# Altium schematic sheet fpga-enet2.SchDoc: Ethernet FPGA
size Legal; CheckedBy: J. Brinton; CompanyName: Signal Laboratories, Inc.; DrawnBy: J. Brinton; Engineer: J. Brinton; Address1: 3479 Edison Way; Address2: Menlo Park CA 94025; Address3: +1 (877) 778-8435; Address4: siglabs.com; DocumentNumber: 26; Revision: 2b; SheetNumber: 27; SheetTotal: 58
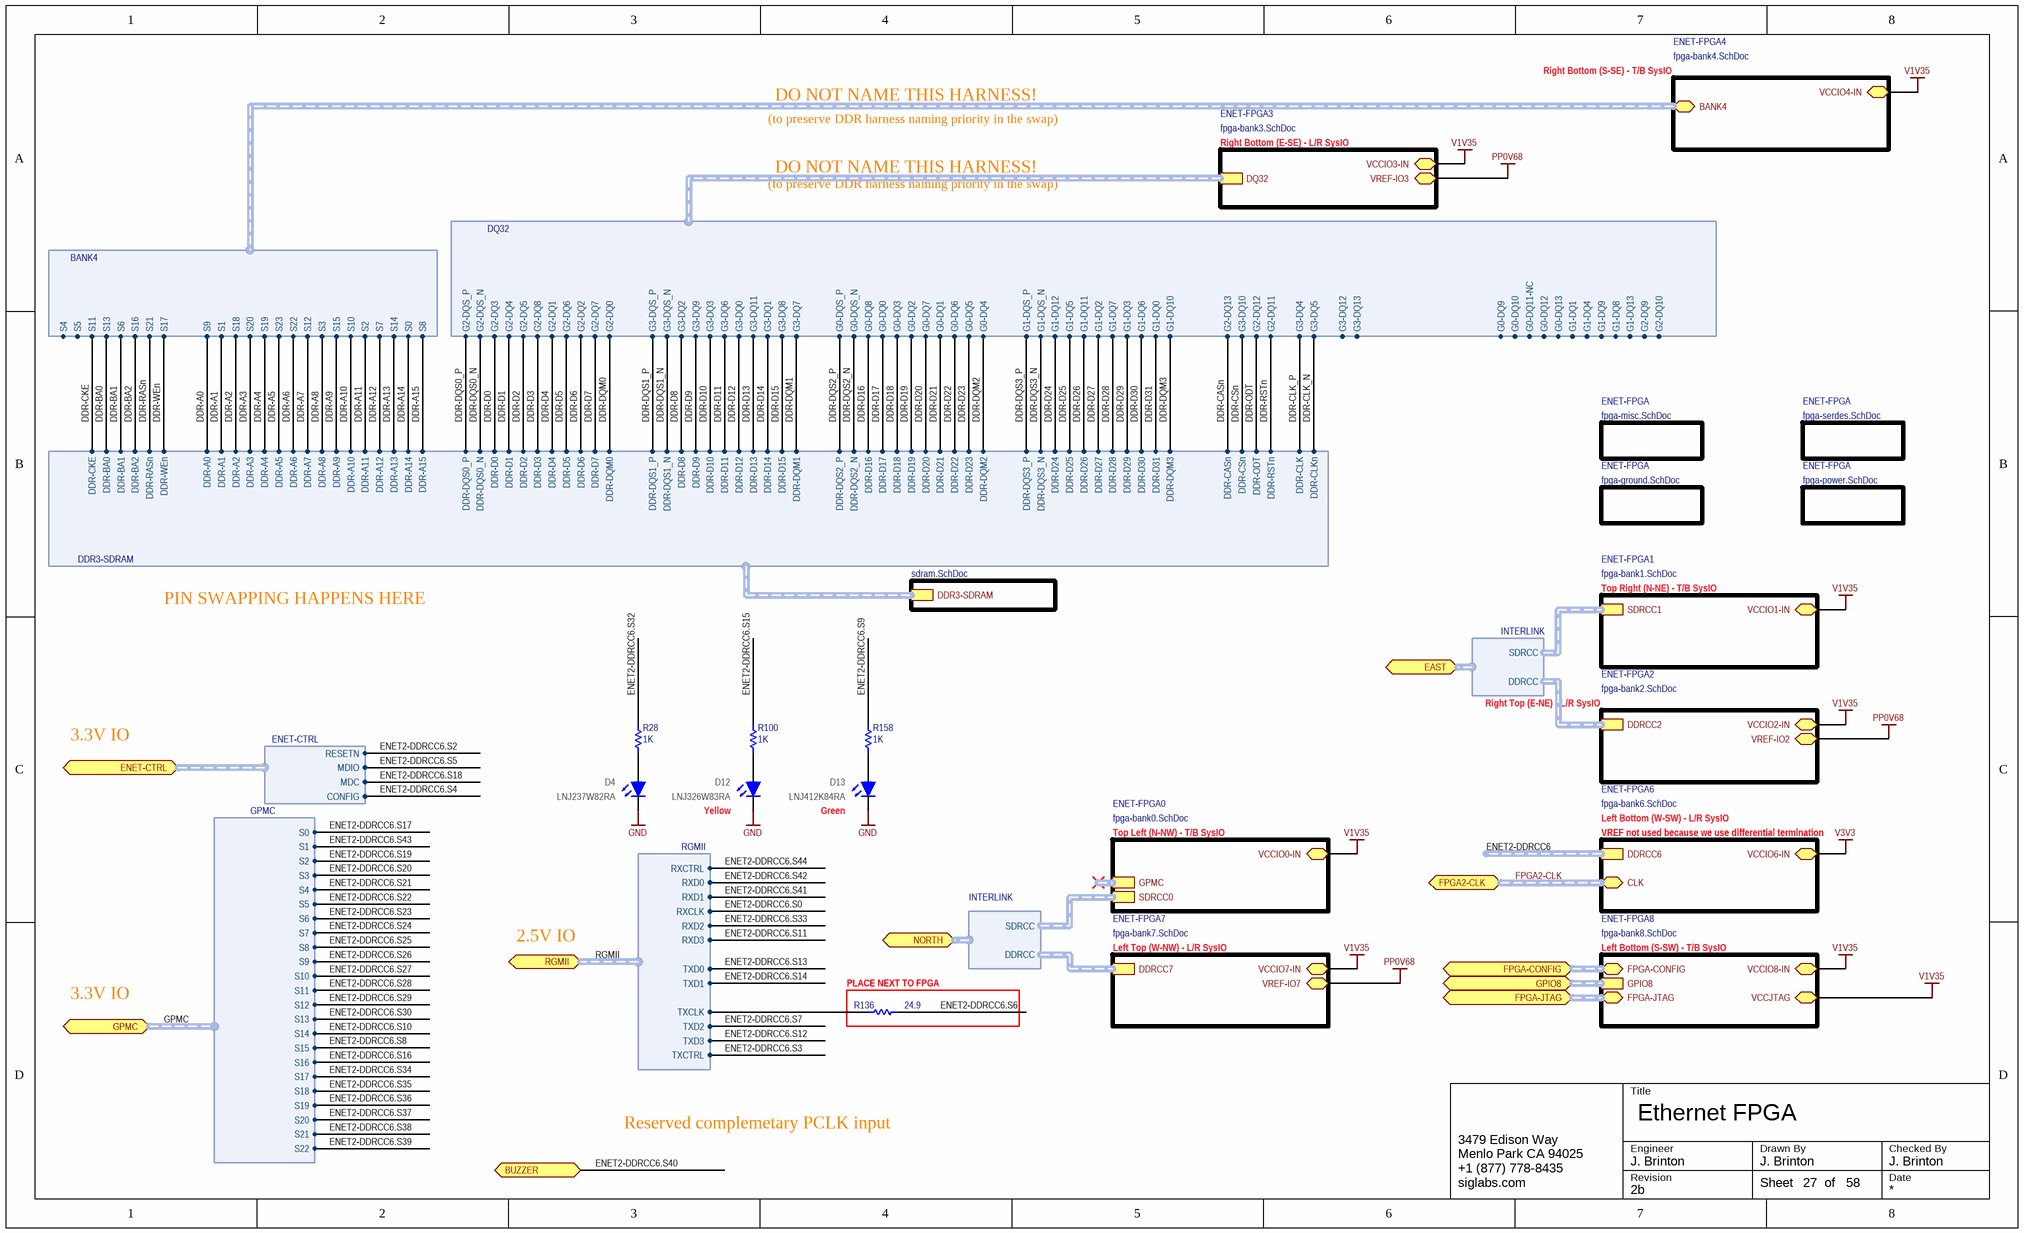
[diagram p0: fpga-enet2.SchDoc]

## Parts
D4  LNJ237W82RA  [0603_LED]
D12  LNJ326W83RA  [0603_LED]
D13  LNJ412K84RA  [0603_LED]
R28  value 1K  [0402]  (hidden comment: RC0402FR-071KL)
R100  value 1K  [0402]  (hidden comment: RC0402FR-071KL)
R136  value 24.9  [0603]  (hidden comment: ERJ-3EKF24R9V)
R158  value 1K  [0402]  (hidden comment: RC0402FR-071KL)

## Blocks framed on the sheet
PLACE NEXT TO FPGA: R136

## Sub-sheets
ENET-FPGA = fpga-ground.SchDoc: no entries
ENET-FPGA = fpga-power.SchDoc: no entries
ENET-FPGA = fpga-misc.SchDoc: no entries
ENET-FPGA = fpga-serdes.SchDoc: no entries
ENET-FPGA0 = fpga-bank0.SchDoc: GPMC (harness GPMC), SDRCC0 (harness SDRCC), VCCIO0-IN
ENET-FPGA1 = fpga-bank1.SchDoc: SDRCC1 (harness SDRCC), VCCIO1-IN
ENET-FPGA2 = fpga-bank2.SchDoc: DDRCC2 (harness DDRCC), VCCIO2-IN, VREF-IO2
ENET-FPGA3 = fpga-bank3.SchDoc: DQ32 (harness DQ32), VREF-IO3, VCCIO3-IN
ENET-FPGA4 = fpga-bank4.SchDoc: VCCIO4-IN, BANK4 (harness BANK4)
ENET-FPGA6 = fpga-bank6.SchDoc: DDRCC6 (harness DDRCC), VCCIO6-IN, CLK (harness CLK-LVPECL33)
ENET-FPGA7 = fpga-bank7.SchDoc: DDRCC7 (harness DDRCC), VREF-IO7, VCCIO7-IN
ENET-FPGA8 = fpga-bank8.SchDoc: GPIO8 (harness GPIO8), FPGA-CONFIG (harness CONF_1V5), FPGA-JTAG (harness FPGA-JTAG), VCCJTAG, VCCIO8-IN
U_sdram = sdram.SchDoc: DDR3-SDRAM (harness DDR3-SDRAM)

## Ports
BUZZER, EAST (harness INTERLINK), ENET-CTRL (harness ENET-CTRL), FPGA2-CLK (harness CLK-LVPECL33), FPGA-CONFIG (harness CONF_1V5), FPGA-JTAG (harness FPGA-JTAG), GPIO8 (harness GPIO8), GPMC (harness GPMC), NORTH (harness INTERLINK), RGMII (harness RGMII)

## Harnesses
INTERLINK: SDRCC, DDRCC
DDR3-SDRAM: DDR-CLK, DDR-CLKn, DDR-CKE, DDR-BA0, DDR-BA1, DDR-BA2, DDR-RASn, DDR-CASn, DDR-WEn, DDR-CSn, DDR-ODT, DDR-RSTn, DDR-A0, DDR-A1, DDR-A2, DDR-A3, DDR-A4, DDR-A5, DDR-A6, DDR-A7, DDR-A8, DDR-A9, DDR-A10, DDR-A11, DDR-A12, DDR-A13, DDR-A14, DDR-A15, DDR-D0, DDR-D1, DDR-D2, DDR-D3, DDR-D4, DDR-D5, DDR-D6, DDR-D7, DDR-DQM0, DDR-DQS0_P, DDR-DQS0_N, DDR-D8, DDR-D9, DDR-D10, DDR-D11, DDR-D12, DDR-D13, DDR-D14, DDR-D15, DDR-DQM1, DDR-DQS1_P, DDR-DQS1_N, DDR-D16, DDR-D17, DDR-D18, DDR-D19, DDR-D20, DDR-D21, DDR-D22, DDR-D23, DDR-DQM2, DDR-DQS2_P, DDR-DQS2_N, DDR-D24, DDR-D25, DDR-D26, DDR-D27, DDR-D28, DDR-D29, DDR-D30, DDR-D31, DDR-DQM3, DDR-DQS3_P, DDR-DQS3_N
RGMII: RXCTRL, RXD0, RXD1, RXD2, RXD3, RXCLK, TXCTRL, TXD0, TXD1, TXD2, TXD3, TXCLK
ENET-CTRL: CONFIG, MDC, MDIO, RESETN
GPMC: S0, S1, S2, S3, S4, S5, S6, S7, S8, S9, S10, S11, S12, S13, S14, S15, S16, S17, S18, S19, S20, S21, S22
DQ32: G0-DQS_P, G0-DQS_N, G0-DQ0, G0-DQ1, G0-DQ2, G0-DQ3, G0-DQ4, G0-DQ5, G0-DQ6, G0-DQ7, G0-DQ8, G0-DQ9, G0-DQ10, G0-DQ11-NC, G0-DQ12, G0-DQ13, G1-DQS_P, G1-DQS_N, G1-DQ0, G1-DQ1, G1-DQ2, G1-DQ3, G1-DQ4, G1-DQ5, G1-DQ6, G1-DQ7, G1-DQ8, G1-DQ9, G1-DQ10, G1-DQ11, G1-DQ12, G1-DQ13, G2-DQS_P, G2-DQS_N, G2-DQ0, G2-DQ1, G2-DQ2, G2-DQ3, G2-DQ4, G2-DQ5, G2-DQ6, G2-DQ7, G2-DQ8, G2-DQ9, G2-DQ10, G2-DQ11, G2-DQ12, G2-DQ13, G3-DQS_P, G3-DQS_N, G3-DQ0, G3-DQ1, G3-DQ2, G3-DQ3, G3-DQ4, G3-DQ5, G3-DQ6, G3-DQ7, G3-DQ8, G3-DQ9, G3-DQ10, G3-DQ11, G3-DQ12, G3-DQ13
BANK4: S0, S1, S2, S3, S4, S5, S6, S7, S8, S9, S10, S11, S12, S13, S14, S15, S16, S17, S18, S19, S20, S21, S22, S23

## Nets
GND: D4.2(K) D12.2(K) D13.2(K)
PP0V68: sheet ENET-FPGA2/VREF-IO2, sheet ENET-FPGA3/VREF-IO3, sheet ENET-FPGA7/VREF-IO7
V1V35: sheet ENET-FPGA0/VCCIO0-IN, sheet ENET-FPGA1/VCCIO1-IN, sheet ENET-FPGA2/VCCIO2-IN, sheet ENET-FPGA3/VCCIO3-IN, sheet ENET-FPGA4/VCCIO4-IN, sheet ENET-FPGA7/VCCIO7-IN, sheet ENET-FPGA8/VCCJTAG, sheet ENET-FPGA8/VCCIO8-IN
V3V3: sheet ENET-FPGA6/VCCIO6-IN
DDR-A0: sheet U_sdram/DDR3-SDRAM.DDR-A0, sheet ENET-FPGA4/BANK4.S9
DDR-A1: sheet U_sdram/DDR3-SDRAM.DDR-A1, sheet ENET-FPGA4/BANK4.S1
DDR-A2: sheet U_sdram/DDR3-SDRAM.DDR-A2, sheet ENET-FPGA4/BANK4.S18
DDR-A3: sheet U_sdram/DDR3-SDRAM.DDR-A3, sheet ENET-FPGA4/BANK4.S20
DDR-A4: sheet U_sdram/DDR3-SDRAM.DDR-A4, sheet ENET-FPGA4/BANK4.S19
DDR-A5: sheet U_sdram/DDR3-SDRAM.DDR-A5, sheet ENET-FPGA4/BANK4.S23
DDR-A6: sheet U_sdram/DDR3-SDRAM.DDR-A6, sheet ENET-FPGA4/BANK4.S22
DDR-A7: sheet U_sdram/DDR3-SDRAM.DDR-A7, sheet ENET-FPGA4/BANK4.S12
DDR-A8: sheet U_sdram/DDR3-SDRAM.DDR-A8, sheet ENET-FPGA4/BANK4.S3
DDR-A9: sheet U_sdram/DDR3-SDRAM.DDR-A9, sheet ENET-FPGA4/BANK4.S15
DDR-A10: sheet U_sdram/DDR3-SDRAM.DDR-A10, sheet ENET-FPGA4/BANK4.S10
DDR-A11: sheet U_sdram/DDR3-SDRAM.DDR-A11, sheet ENET-FPGA4/BANK4.S2
DDR-A12: sheet U_sdram/DDR3-SDRAM.DDR-A12, sheet ENET-FPGA4/BANK4.S7
DDR-A13: sheet U_sdram/DDR3-SDRAM.DDR-A13, sheet ENET-FPGA4/BANK4.S14
DDR-A14: sheet U_sdram/DDR3-SDRAM.DDR-A14, sheet ENET-FPGA4/BANK4.S0
DDR-A15: sheet U_sdram/DDR3-SDRAM.DDR-A15, sheet ENET-FPGA4/BANK4.S8
DDR-BA0: sheet U_sdram/DDR3-SDRAM.DDR-BA0, sheet ENET-FPGA4/BANK4.S13
DDR-BA1: sheet U_sdram/DDR3-SDRAM.DDR-BA1, sheet ENET-FPGA4/BANK4.S6
DDR-BA2: sheet U_sdram/DDR3-SDRAM.DDR-BA2, sheet ENET-FPGA4/BANK4.S16
DDR-CASn: sheet U_sdram/DDR3-SDRAM.DDR-CASn, sheet ENET-FPGA3/DQ32.G2-DQ13
DDR-CKE: sheet U_sdram/DDR3-SDRAM.DDR-CKE, sheet ENET-FPGA4/BANK4.S11
DDR-CLK_N: sheet U_sdram/DDR3-SDRAM.DDR-CLKn, sheet ENET-FPGA3/DQ32.G3-DQ5
DDR-CLK_P: sheet U_sdram/DDR3-SDRAM.DDR-CLK, sheet ENET-FPGA3/DQ32.G3-DQ4
DDR-CSn: sheet U_sdram/DDR3-SDRAM.DDR-CSn, sheet ENET-FPGA3/DQ32.G3-DQ10
DDR-D0: sheet U_sdram/DDR3-SDRAM.DDR-D0, sheet ENET-FPGA3/DQ32.G2-DQ3
DDR-D1: sheet U_sdram/DDR3-SDRAM.DDR-D1, sheet ENET-FPGA3/DQ32.G2-DQ4
DDR-D2: sheet U_sdram/DDR3-SDRAM.DDR-D2, sheet ENET-FPGA3/DQ32.G2-DQ5
DDR-D3: sheet U_sdram/DDR3-SDRAM.DDR-D3, sheet ENET-FPGA3/DQ32.G2-DQ8
DDR-D4: sheet U_sdram/DDR3-SDRAM.DDR-D4, sheet ENET-FPGA3/DQ32.G2-DQ1
DDR-D5: sheet U_sdram/DDR3-SDRAM.DDR-D5, sheet ENET-FPGA3/DQ32.G2-DQ6
DDR-D6: sheet U_sdram/DDR3-SDRAM.DDR-D6, sheet ENET-FPGA3/DQ32.G2-DQ2
DDR-D7: sheet U_sdram/DDR3-SDRAM.DDR-D7, sheet ENET-FPGA3/DQ32.G2-DQ7
DDR-D8: sheet U_sdram/DDR3-SDRAM.DDR-D8, sheet ENET-FPGA3/DQ32.G3-DQ2
DDR-D9: sheet U_sdram/DDR3-SDRAM.DDR-D9, sheet ENET-FPGA3/DQ32.G3-DQ9
DDR-D10: sheet U_sdram/DDR3-SDRAM.DDR-D10, sheet ENET-FPGA3/DQ32.G3-DQ3
DDR-D11: sheet U_sdram/DDR3-SDRAM.DDR-D11, sheet ENET-FPGA3/DQ32.G3-DQ6
DDR-D12: sheet U_sdram/DDR3-SDRAM.DDR-D12, sheet ENET-FPGA3/DQ32.G3-DQ0
DDR-D13: sheet U_sdram/DDR3-SDRAM.DDR-D13, sheet ENET-FPGA3/DQ32.G3-DQ11
DDR-D14: sheet U_sdram/DDR3-SDRAM.DDR-D14, sheet ENET-FPGA3/DQ32.G3-DQ1
DDR-D15: sheet U_sdram/DDR3-SDRAM.DDR-D15, sheet ENET-FPGA3/DQ32.G3-DQ8
DDR-D16: sheet U_sdram/DDR3-SDRAM.DDR-D16, sheet ENET-FPGA3/DQ32.G0-DQ8
DDR-D17: sheet U_sdram/DDR3-SDRAM.DDR-D17, sheet ENET-FPGA3/DQ32.G0-DQ0
DDR-D18: sheet U_sdram/DDR3-SDRAM.DDR-D18, sheet ENET-FPGA3/DQ32.G0-DQ3
DDR-D19: sheet U_sdram/DDR3-SDRAM.DDR-D19, sheet ENET-FPGA3/DQ32.G0-DQ2
DDR-D20: sheet U_sdram/DDR3-SDRAM.DDR-D20, sheet ENET-FPGA3/DQ32.G0-DQ7
DDR-D21: sheet U_sdram/DDR3-SDRAM.DDR-D21, sheet ENET-FPGA3/DQ32.G0-DQ1
DDR-D22: sheet U_sdram/DDR3-SDRAM.DDR-D22, sheet ENET-FPGA3/DQ32.G0-DQ6
DDR-D23: sheet U_sdram/DDR3-SDRAM.DDR-D23, sheet ENET-FPGA3/DQ32.G0-DQ5
DDR-D24: sheet U_sdram/DDR3-SDRAM.DDR-D24, sheet ENET-FPGA3/DQ32.G1-DQ12
DDR-D25: sheet U_sdram/DDR3-SDRAM.DDR-D25, sheet ENET-FPGA3/DQ32.G1-DQ5
DDR-D26: sheet U_sdram/DDR3-SDRAM.DDR-D26, sheet ENET-FPGA3/DQ32.G1-DQ11
DDR-D27: sheet U_sdram/DDR3-SDRAM.DDR-D27, sheet ENET-FPGA3/DQ32.G1-DQ2
DDR-D28: sheet U_sdram/DDR3-SDRAM.DDR-D28, sheet ENET-FPGA3/DQ32.G1-DQ7
DDR-D29: sheet U_sdram/DDR3-SDRAM.DDR-D29, sheet ENET-FPGA3/DQ32.G1-DQ3
DDR-D30: sheet U_sdram/DDR3-SDRAM.DDR-D30, sheet ENET-FPGA3/DQ32.G1-DQ6
DDR-D31: sheet U_sdram/DDR3-SDRAM.DDR-D31, sheet ENET-FPGA3/DQ32.G1-DQ0
DDR-DQM0: sheet U_sdram/DDR3-SDRAM.DDR-DQM0, sheet ENET-FPGA3/DQ32.G2-DQ0
DDR-DQM1: sheet U_sdram/DDR3-SDRAM.DDR-DQM1, sheet ENET-FPGA3/DQ32.G3-DQ7
DDR-DQM2: sheet U_sdram/DDR3-SDRAM.DDR-DQM2, sheet ENET-FPGA3/DQ32.G0-DQ4
DDR-DQM3: sheet U_sdram/DDR3-SDRAM.DDR-DQM3, sheet ENET-FPGA3/DQ32.G1-DQ10
DDR-DQS0_N: sheet U_sdram/DDR3-SDRAM.DDR-DQS0_N, sheet ENET-FPGA3/DQ32.G2-DQS_N
DDR-DQS0_P: sheet U_sdram/DDR3-SDRAM.DDR-DQS0_P, sheet ENET-FPGA3/DQ32.G2-DQS_P
DDR-DQS1_N: sheet U_sdram/DDR3-SDRAM.DDR-DQS1_N, sheet ENET-FPGA3/DQ32.G3-DQS_N
DDR-DQS1_P: sheet U_sdram/DDR3-SDRAM.DDR-DQS1_P, sheet ENET-FPGA3/DQ32.G3-DQS_P
DDR-DQS2_N: sheet U_sdram/DDR3-SDRAM.DDR-DQS2_N, sheet ENET-FPGA3/DQ32.G0-DQS_N
DDR-DQS2_P: sheet U_sdram/DDR3-SDRAM.DDR-DQS2_P, sheet ENET-FPGA3/DQ32.G0-DQS_P
DDR-DQS3_N: sheet U_sdram/DDR3-SDRAM.DDR-DQS3_N, sheet ENET-FPGA3/DQ32.G1-DQS_N
DDR-DQS3_P: sheet U_sdram/DDR3-SDRAM.DDR-DQS3_P, sheet ENET-FPGA3/DQ32.G1-DQS_P
DDR-ODT: sheet U_sdram/DDR3-SDRAM.DDR-ODT, sheet ENET-FPGA3/DQ32.G2-DQ12
DDR-RASn: sheet U_sdram/DDR3-SDRAM.DDR-RASn, sheet ENET-FPGA4/BANK4.S21
DDR-RSTn: sheet U_sdram/DDR3-SDRAM.DDR-RSTn, sheet ENET-FPGA3/DQ32.G2-DQ11
DDR-WEn: sheet U_sdram/DDR3-SDRAM.DDR-WEn, sheet ENET-FPGA4/BANK4.S17
ENET2-DDRCC6.S0: port RGMII.RXCLK
ENET2-DDRCC6.S2: port ENET-CTRL.RESETN
ENET2-DDRCC6.S3: port RGMII.TXCTRL
ENET2-DDRCC6.S4: port ENET-CTRL.CONFIG
ENET2-DDRCC6.S5: port ENET-CTRL.MDIO
ENET2-DDRCC6.S6: R136.2
ENET2-DDRCC6.S7: port RGMII.TXD2
ENET2-DDRCC6.S8: port GPMC.S15
ENET2-DDRCC6.S9: R158.2
ENET2-DDRCC6.S10: port GPMC.S14
ENET2-DDRCC6.S11: port RGMII.RXD3
ENET2-DDRCC6.S12: port RGMII.TXD3
ENET2-DDRCC6.S13: port RGMII.TXD0
ENET2-DDRCC6.S14: port RGMII.TXD1
ENET2-DDRCC6.S15: R100.2
ENET2-DDRCC6.S16: port GPMC.S16
ENET2-DDRCC6.S17: port GPMC.S0
ENET2-DDRCC6.S18: port ENET-CTRL.MDC
ENET2-DDRCC6.S19: port GPMC.S2
ENET2-DDRCC6.S20: port GPMC.S3
ENET2-DDRCC6.S21: port GPMC.S4
ENET2-DDRCC6.S22: port GPMC.S5
ENET2-DDRCC6.S23: port GPMC.S6
ENET2-DDRCC6.S24: port GPMC.S7
ENET2-DDRCC6.S25: port GPMC.S8
ENET2-DDRCC6.S26: port GPMC.S9
ENET2-DDRCC6.S27: port GPMC.S10
ENET2-DDRCC6.S28: port GPMC.S11
ENET2-DDRCC6.S29: port GPMC.S12
ENET2-DDRCC6.S30: port GPMC.S13
ENET2-DDRCC6.S32: R28.2
ENET2-DDRCC6.S33: port RGMII.RXD2
ENET2-DDRCC6.S34: port GPMC.S17
ENET2-DDRCC6.S35: port GPMC.S18
ENET2-DDRCC6.S36: port GPMC.S19
ENET2-DDRCC6.S37: port GPMC.S20
ENET2-DDRCC6.S38: port GPMC.S21
ENET2-DDRCC6.S39: port GPMC.S22
ENET2-DDRCC6.S40: port BUZZER
ENET2-DDRCC6.S41: port RGMII.RXD1
ENET2-DDRCC6.S42: port RGMII.RXD0
ENET2-DDRCC6.S43: port GPMC.S1
ENET2-DDRCC6.S44: port RGMII.RXCTRL
RGMII.TXCLK: R136.1 ; port RGMII.TXCLK
NetD4_1: D4.1(A) R28.1
NetD12_1: D12.1(A) R100.1
NetD13_1: D13.1(A) R158.1

## Buses and harness runs
harness ENET2-DDRCC6 = sheet ENET-FPGA6/DDRCC6
harness FPGA2-CLK = port FPGA2-CLK = sheet ENET-FPGA6/CLK
harness GPMC = port GPMC
harness port FPGA-CONFIG = sheet ENET-FPGA8/FPGA-CONFIG
harness port FPGA-JTAG = sheet ENET-FPGA8/FPGA-JTAG
harness port GPIO8 = sheet ENET-FPGA8/GPIO8
harness RGMII = port RGMII

## Notes on the sheet
- DO NOT NAME THIS HARNESS!
- Right Bottom (S-SE) - T/B SysIO
- (to preserve DDR harness naming priority in the swap)
- Right Bottom (E-SE) - L/R SysIO
- PIN SWAPPING HAPPENS HERE
- Top Right (N-NE) - T/B SysIO
- 3.3V IO
- Right Top (E-NE) - L/R SysIO
- (near D12) Yellow
- (near D13) Green
- Left Bottom (W-SW) - L/R SysIO
- Top Left (N-NW) - T/B SysIO
- VREF not used because we use differential termination
- 2.5V IO
- Left Top (W-NW) - L/R SysIO
- Left Bottom (S-SW) - T/B SysIO
- Reserved complemetary PCLK input
- Title
- Engineer
- Revision
- Drawn By
- Checked By
- Date
- Sheet
- of

## Library data of the parts
D4 = LED0603RD: LED, SMT 0603, Color Red, 5mA, 1.85V; Manufacturer: Panasonic; Manufacturer P/N: LNJ237W82RA; Package: 0603 Polarized
D12 = LED0603GR: LED, SMT 0603, Color Green, 10mA, 2.05V; Manufacturer: Panasonic; Manufacturer P/N: LNJ326W83RA; Package: 0603 Polarized
D13 = LED0603Y: LED, SMT 0603, Color Yellow, 10mA, 2.05V; Manufacturer: Panasonic; Manufacturer P/N: LNJ412K84RA; Package: 0603 Polarized
R28 R100 R158 = RES 0402: Thick Film Resistor 1k ±1% 0402; Manufacturer: Yageo; Tr: -55:155; Package: 0402; Manufacturer P/N: RC0402FR-071KL; Do Not Place: *; Tolerance: ±1%
R136 = RES 0603: Thick Film Resistor 24.9 ±1% 0603; Manufacturer: Panasonic; Tr: -55:155; Package: 0603; Manufacturer P/N: ERJ-3EKF24R9V; Do Not Place: *; Tolerance: ±1%